# EasyEDA Pro project hub+remap_2025-11-01.epro

# Board hub+remap
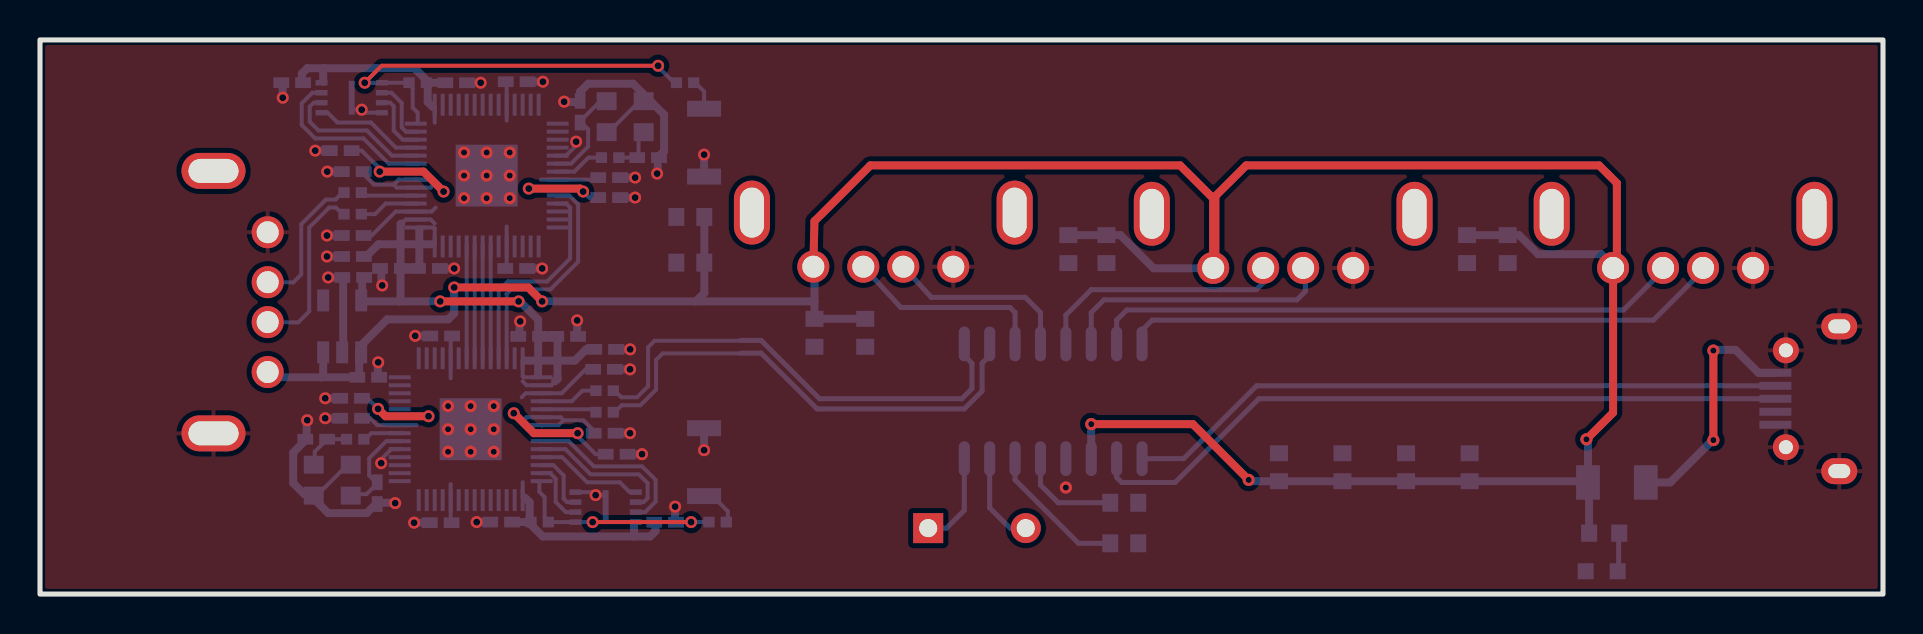
[diagram p0: board, top side]
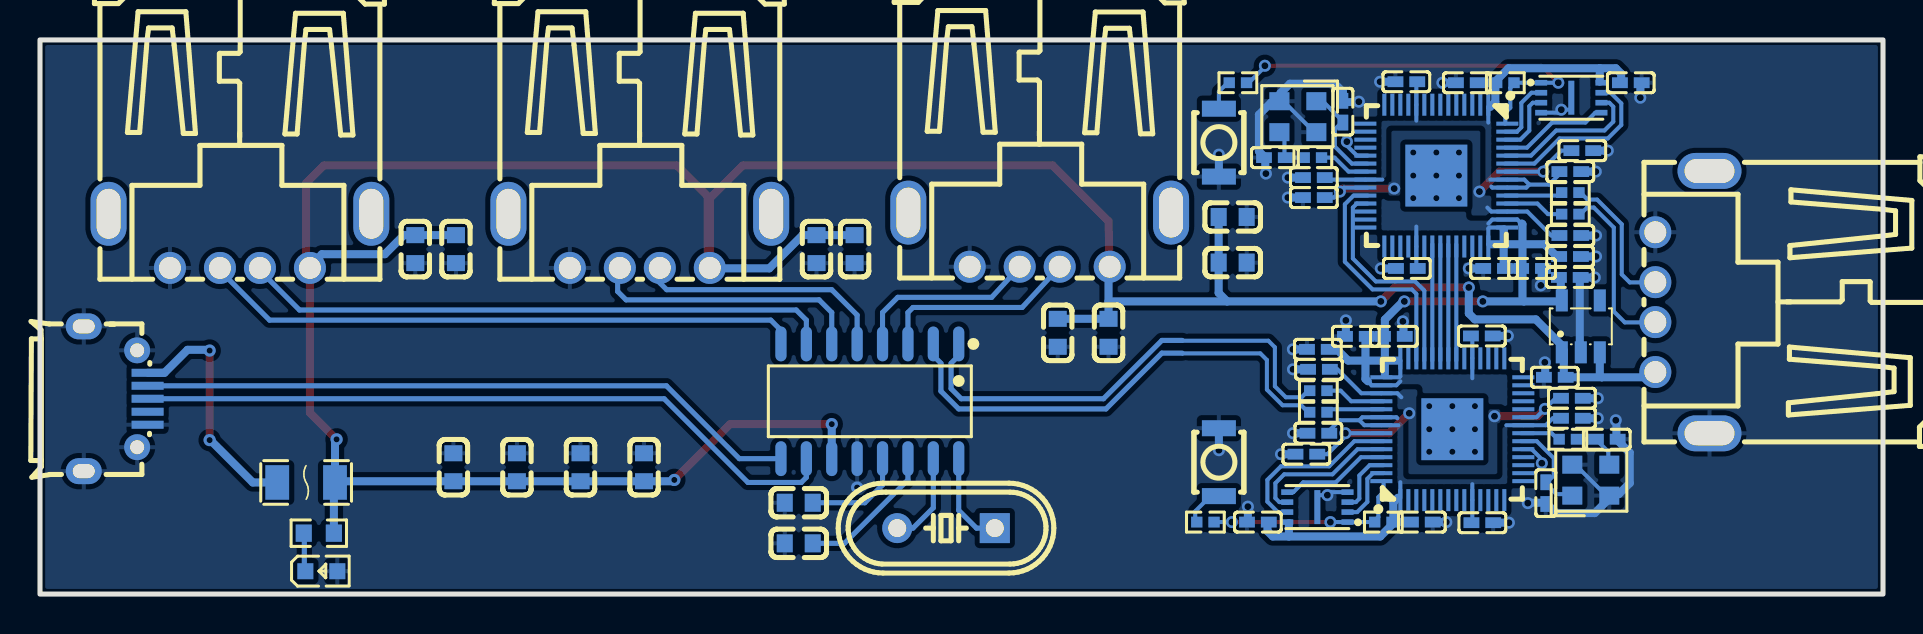
[diagram p1: board, bottom side, seen from below]

Outline 92.18 x 27.75 mm; copper layers: Top Layer, Bottom Layer. Coordinates in mm from the lower left corner of the outline.
Outline path: rectangle 92.18,0 0,27.75
Stack: Top Layer 0.035mm / Dielectric1 1.51mm FR4 er 4.5 / Bottom Layer 0.035mm

## Design rules (mm)
template: JLCPCB Capability(Two Layers Board)
spacing copperThickness1oz (default): track to track 0.102, other pairs 0.152 to 0.3
spacing copperThickness2oz: track to track 0.203, other pairs 0.152 to 0.3
track width copperThickness1oz (default): min 0.127, default 0.254, max 2.54
track width copperThickness2oz: min 0.203, default 0.254, max 2.54
differential pair differentialPair (default): width min 0.127, default 0.254, max 2.54; gap min 0.152, default 0.152
via viaSize (default): diameter min 0.5, default 0.61, max 10; hole min 0.3, default 0.305, max 6.3

## Placement (name value [footprint] x y rotation side)
C1  -  [C0603]  54.23 2.54 0 bottom
C1#2  -  [C0402]  15.04 22.2 180 bottom
C2  -  [C0603]  54.23 4.57 0 bottom
C2#2  -  [C0402]  28.47 19.85 0 bottom
C3  -  [C0603]  73.41 17.27 270 bottom
C3#2  -  [C0402]  15.64 21.15 180 bottom
C4  -  [C0603]  32.53 18.88 180 bottom
C4#2  -  [C0402]  20.82 25.6 0 bottom
C5  -  [C0603]  53.34 17.27 270 bottom
C5#2  -  [C0402]  23.82 16.3 0 bottom
C6  -  [C0603]  71.37 17.27 270 bottom
C6#2  -  [C0402]  23.84 25.65 0 bottom
C7  -  [C0603]  51.44 17.27 270 bottom
C7#2  -  [C0402]  28.47 20.85 0 bottom
C8  -  [C0603]  68.32 6.35 90 bottom
C8#2  -  [C0402]  19.45 16.3 0 bottom
C9  -  [C0603]  38.74 13.08 270 bottom
C9#2  -  [C0402]  17.55 16.3 180 bottom
C10  -  [C0603]  41.28 13.08 270 bottom
C10#2  -  [C0402]  15.65 16.9 180 bottom
C11  10uF  [C0603]  65.14 6.35 90 bottom
C12  100nF  [C0603]  32.53 16.6 180 bottom
C13  -  [C0603]  71.5 6.35 90 bottom
C13#2  -  [C0402]  15.64 17.95 180 bottom
C14  100nF  [C0603]  61.97 6.35 90 bottom
C15  1uF  [C0402]  16.42 10.85 0 bottom
C16  1uF  [C0402]  15.67 15.85 180 bottom
C17  100nF  [C0402]  12.62 25.6 180 bottom
C18  15pF  [C0402]  27.02 24.15 270 bottom
C19  15pF  [C0402]  30.41 21.85 0 bottom
C101  100nF  [C0402]  28.84 7 0 bottom
C102  100nF  [C0402]  15.56 9.8 180 bottom
C103  100nF  [C0402]  28.24 8.05 0 bottom
C104  100nF  [C0402]  23.07 3.6 180 bottom
C105  100nF  [C0402]  20.07 12.92 180 bottom
C106  100nF  [C0402]  20.04 3.57 180 bottom
C107  100nF  [C0402]  15.56 8.8 180 bottom
C108  100nF  [C0402]  24.47 12.9 180 bottom
C109  100nF  [C0402]  26.37 12.9 0 bottom
C110  1uF  [C0402]  28.27 12.25 0 bottom
C113  1uF  [C0402]  28.21 11.25 0 bottom
C117  100nF  [C0402]  31.27 3.6 0 bottom
C118  15pF  [C0402]  16.87 5.05 90 bottom
C119  15pF  [C0402]  13.82 7.75 180 bottom
F1  FSMD100-1206R  [F1206]  78.87 5.59 0 bottom
LED1  19-217/R6C-AL1M2VY/3T  [LED0603-RD]  78.11 1.14 180 bottom
R1  2kΩ  [R0603]  78.23 3.05 0 bottom
R3  27Ω  [R0402]  15.64 20.1 0 bottom
R4  27Ω  [R0402]  15.64 19.02 0 bottom
R5  10kΩ  [R0402]  18.89 25.6 180 bottom
R6  1kΩ  [R0402]  32.27 25.6 0 bottom
R7  1kΩ  [R0402]  28.52 21.85 180 bottom
R103  27Ω  [R0402]  28.24 9.1 180 bottom
R104  27Ω  [R0402]  28.24 10.18 180 bottom
R105  10kΩ  [R0402]  24.99 3.6 0 bottom
R106  1kΩ  [R0402]  33.89 3.6 0 bottom
R107  1kΩ  [R0402]  15.77 7.75 0 bottom
SW2  B3U-1000P  [KEY-SMD_B3U-1000PM]  33.22 22.6 90 bottom
SW102  B3U-1000P  [KEY-SMD_B3U-1000PM]  33.22 6.6 270 bottom
U1  SL2.1A  [SOP-16_L10.0-W3.9-P1.27-LS6.0-BL]  50.67 9.65 0 bottom
U3  RP2040  [LQFN-56_L7.0-W7.0-P0.4-EP]  22.34 20.95 270 bottom
U4  TLV73333PDBVR  [SOT-23-5_L3.0-W1.7-P0.95-LS2.8-BR]  15.12 13.4 270 bottom
U5  W25Q16JVUXIQ  [USON-8_L3.0-W2.0-P0.50-BL-EP]  15.59 24.85 270 bottom
U103  RP2040  [LQFN-56_L7.0-W7.0-P0.4-EP]  21.54 8.25 90 bottom
U105  W25Q16JVUXIQ  [USON-8_L3.0-W2.0-P0.50-BL-EP]  28.29 4.35 90 bottom
USB1  -  [USB-A-TH_USB-302-T]  10.03 14.62 90 bottom
USB1#2  -  [MICRO-USB-SMD_MICROXNJ]  88.39 9.78 270 bottom
USB2  U-USBAR04P-F002  [USB-A-TH_USB-302-T]  82.18 17.69 0 bottom
USB3  U-USBAR04P-F002  [USB-A-TH_USB-302-T]  62.18 17.69 0 bottom
USB4  U-USBAR04P-F002  [USB-A-TH_USB-302-T]  42.18 17.75 0 bottom
X1  12MHz  [HC-49US_L11.5-W4.5-P4.88]  46.86 3.3 0 bottom
Y1  12MHz  [CRYSTAL-SMD_4P-L2.5-W2.0-BL-A]  29.27 23.9 0 bottom
Y101  12MHz  [CRYSTAL-SMD_4P-L2.5-W2.0-BL-A]  14.62 5.7 180 bottom

## Footprints (pads in the part's own frame, mm; a bottom-side part is the same pattern mirrored in y, then rotated)
C0402
  rect 0.79x0.54 smd: 1(-0.545,0) 2(0.545,0)
C0603
  rect 0.8x0.9 smd: 1(-0.7,0) 2(0.7,0)
CRYSTAL-SMD_4P-L2.5-W2.0-BL-A
  rect 1x0.9 smd: 1(-0.925,-0.775) 2(0.925,-0.775) 3(0.925,0.775) 4(-0.925,0.775)
F1206
  rect 1.19x1.728 smd: 1(-1.445,0) 2(1.445,0)
HC-49US_L11.5-W4.5-P4.88
  rect 1.5x1.5 hole 0.9: 1(-2.44,0)
  round 1.5 hole 0.9: 2(2.44,0)
KEY-SMD_B3U-1000PM
  rect 0.8x1.7 smd: 1(-1.7,0) 2(1.7,0)
LED0603-RD
  rect 0.8x0.8 smd: 1(-0.799,0) 2(0.799,0)
LQFN-56_L7.0-W7.0-P0.4-EP
  rect 1.1x0.2 smd: 1(-3.55,2.6) 2(-3.55,2.2) 3(-3.55,1.8) 4(-3.55,1.4) 5(-3.55,1) 6(-3.55,0.6) 7(-3.55,0.2) 8(-3.55,-0.2) 9(-3.55,-0.6) 10(-3.55,-1) 11(-3.55,-1.4) 12(-3.55,-1.8) 13(-3.55,-2.2) 14(-3.55,-2.6) 29(3.55,-2.6) 30(3.55,-2.2) 31(3.55,-1.8) 32(3.55,-1.4) 33(3.55,-1) 34(3.55,-0.6) 35(3.55,-0.2) 36(3.55,0.2) 37(3.55,0.6) 38(3.55,1) 39(3.55,1.4) 40(3.55,1.8) 41(3.55,2.2) 42(3.55,2.6)
  rect 0.2x1.1 smd: 15(-2.6,-3.55) 16(-2.2,-3.55) 17(-1.8,-3.55) 18(-1.4,-3.55) 19(-1,-3.55) 20(-0.6,-3.55) 21(-0.2,-3.55) 22(0.2,-3.55) 23(0.6,-3.55) 24(1,-3.55) 25(1.4,-3.55) 26(1.8,-3.55) 27(2.2,-3.55) 28(2.6,-3.55) 43(2.6,3.55) 44(2.2,3.55) 45(1.8,3.55) 46(1.4,3.55) 47(1,3.55) 48(0.6,3.55) 49(0.2,3.55) 50(-0.2,3.55) 51(-0.6,3.55) 52(-1,3.55) 53(-1.4,3.55) 54(-1.8,3.55) 55(-2.2,3.55) 56(-2.6,3.55)
  rect 3.1x3.1 smd: 57(0,0)
MICRO-USB-SMD_MICROXNJ
  rect 0.4x1.6 smd: 1(-1.3,1.597) 2(-0.65,1.597) 3(0,1.597) 4(0.65,1.597) 5(1.3,1.597)
  round 1.3 hole 0.7: 6(2.425,1.074) 9(-2.425,1.073)
  oval 1.3x1.8 hole 0.7x1.1: 7(3.625,-1.597) 8(-3.625,-1.597)
R0402
  rect 0.566x0.54 smd: 1(-0.433,0) 2(0.433,0)
R0603
  rect 0.806x0.864 smd: 1(-0.753,0) 2(0.753,0)
SOP-16_L10.0-W3.9-P1.27-LS6.0-BL
  oval 0.56x1.745 smd: 1(-4.445,-2.873) 2(-3.175,-2.873) 3(-1.905,-2.873) 4(-0.635,-2.873) 5(0.635,-2.873) 6(1.905,-2.873) 7(3.175,-2.873) 8(4.445,-2.873) 9(4.445,2.873) 10(3.175,2.873) 11(1.905,2.873) 12(0.635,2.873) 13(-0.635,2.873) 14(-1.905,2.873) 15(-3.175,2.873) 16(-4.445,2.873)
SOT-23-5_L3.0-W1.7-P0.95-LS2.8-BR
  rect 1.1x0.6 smd: 1(1.3,-0.95) 2(1.3,0) 3(1.3,0.95) 4(-1.3,0.95) 5(-1.3,-0.95)
USB-A-TH_USB-302-T
  round 1.6 hole 1.1: 1(-3.5,1.355) 2(-1,1.355) 3(1,1.355) 4(3.5,1.355)
  oval 1.8x3.2 hole 1.2x2.5: 5(-6.57,-1.355) 6(6.57,-1.355)
USON-8_L3.0-W2.0-P0.50-BL-EP
  rect 0.28x0.6 smd: 1(-0.75,-1.508) 2(-0.25,-1.508) 3(0.25,-1.508) 4(0.75,-1.508) 5(0.75,1.508) 6(0.25,1.508) 7(-0.25,1.508) 8(-0.75,1.508)
  rect 1.7x0.3 smd: 9(0,0)

## Nets
+1V1: C1#2.1 C2#2.1 C13#2.1 U3.23 U3.45 U3.50
+1V2: C101.1 C102.1 C113.1 U103.23 U103.45 U103.50
+3V3: C3#2.1 C4#2.1 C5#2.1 C6#2.1 C7#2.1 C8#2.1 C9#2.1 C10#2.1 C16.1 C17.1 C103.1 C104.1 C105.1 C106.1 C107.1 C108.1 C109.1 C110.1 C117.1 R5.1 R105.1 U3.1 U3.10 U3.22 U3.33 U3.42 U3.43 U3.44 U3.48 U3.49 U4.5 U5.8 U103.1 U103.10 U103.22 U103.33 U103.42 U103.43 U103.44 U103.48 U103.49 U105.8
+5V: C3.1 C4.1 C5.1 C6.1 C7.1 C8.1 C9.1 C10.1 C11.1 C12.1 C13.1 C14.1 C15.1 F1.1 R1.1 U1.11 U4.1 U4.3 USB1.1 USB2.1 USB3.1 USB4.1
GND: C1.2 C1#2.2 C2.2 C2#2.2 C3.2 C3#2.2 C4.2 C4#2.2 C5.2 C5#2.2 C6.2 C6#2.2 C7.2 C7#2.2 C8.2 C8#2.2 C9.2 C9#2.2 C10.2 C10#2.2 C11.2 C12.2 C13.2 C13#2.2 C14.2 C15.2 C16.2 C17.2 C18.1 C19.2 C101.2 C102.2 C103.2 C104.2 C105.2 C106.2 C107.2 C108.2 C109.2 C110.2 C113.2 C117.2 C118.1 C119.2 LED1.2 SW2.1 SW102.1 U1.12 U3.19 U3.57 U4.2 U5.4 U103.19 U103.57 U105.4 USB1.4 USB1.5 USB1#2.5 USB1#2.6 USB1#2.7 USB1#2.8 USB1#2.9 USB2.4 USB3.4 USB4.4 Y1.2 Y1.4 Y101.2 Y101.4
VBUS: F1.2 USB1#2.1
VDD18: C1.1 U1.14
VDD33: C2.1 U1.13
1D+: R103.1
1D-: R104.1
1GPIO0: U103.2
1GPIO1: U103.3
1GPIO4: U103.6
1GPIO5: U103.7
1QSPI_SCLK: U103.52 U105.6
1QSPI_SD0: U103.53 U105.5
1QSPI_SD1: U103.55 U105.2
1QSPI_SD2: U103.54 U105.3
1QSPI_SD3: U103.51 U105.7
1QSPI_SS: R105.2 R106.1 U103.56 U105.1
1XIN: C118.2 U103.20 Y101.1
1XOUT: R107.2 U103.21
$C19_1: C19.1 R7.1 Y1.3
$C119_1: C119.1 R107.1 Y101.3
$LED1_1: LED1.1 R1.2
$R3_2: R3.2 U3.47
$R4_2: R4.2 U3.46
$R6_2: R6.2 SW2.2
$R103_2: R103.2 U103.47
$R104_2: R104.2 U103.46
$R106_2: R106.2 SW102.2
CTS1RTS: U3.38 U103.35
D+: R3.1 USB1.3
D-: R4.1 USB1.2
DM: U1.9 USB1#2.2
DM1: U1.7 USB2.2
DM2: U1.5 USB3.2
DM3: U1.3 USB4.2
DM4: U1.1
DP: U1.10 USB1#2.3
DP1: U1.8 USB2.3
DP2: U1.6 USB3.3
DP3: U1.4 USB4.3
DP4: U1.2
GPIO0: U3.2
GPIO1: U3.3
GPIO4: U3.6
GPIO5: U3.7
QSPI_SCLK: U3.52 U5.6
QSPI_SD0: U3.53 U5.5
QSPI_SD1: U3.55 U5.2
QSPI_SD2: U3.54 U5.3
QSPI_SD3: U3.51 U5.7
QSPI_SS: R5.2 R6.1 U3.56 U5.1
RTS1CTS: U3.35 U103.38
RX1TX: U3.37 U103.36
SWCLK: U3.24 U103.40
SWD: U3.25 U103.39
TX1RX: U3.36 U103.37
XIN: C18.2 U1.16 U3.20 X1.1 Y1.1
XOUT: R7.2 U1.15 U3.21 X1.2

Pads without a net: U3 4 5 8 9 11 12 13 14 15 16 17 18 26 27 28 29 30 31 32 34 39 40 41; U4 4; U5 9; U103 4 5 8 9 11 12 13 14 15 16 17 18 24 25 26 27 28 29 30 31 32 34 41; U105 9; USB1 6; USB1#2 4; USB2 5 6; USB3 5 6; USB4 5 6

## Via types
v1: diameter 0.6, hole 0.35, Top Layer to Bottom Layer, 52 vias
v2: diameter 0.61, hole 0.305, Top Layer to Bottom Layer, 24 vias

## Routing (per net, layer and track width the routed paths; a pad name or vN(x,y) marks a point on that pad's centre or on a via; arc(x,y) is an arc through that point)
+1V1: length 17
  Top Layer w0.4: v1(27.16,20.15) 27.02,20.3 v1(24.45,20.3) ; v1(16.99,21.15) 19.19,21.15 v1(20.19,20.15)
  Bottom Layer w0.2: 15.52,22.2 16.09,22.2 16.99,21.3 v1(16.99,21.15) 18.9,21.15 ; 16.12,17.95 16.59,17.95 17.79,19.15 U3.45 19.59,19.15 19.79,19.35 ; 27.99,19.85 27.47,19.85 v1(27.16,20.15) 26.97,20.35 25.78,20.35
+1V2: length 16.9
  Top Layer w0.4: v1(19.43,8.9) 17.28,8.9 v1(16.91,9.27) ; 23.7,9.05 24.7,8.05 26.9,8.05
  Bottom Layer w0.2: 16.04,9.8 16.38,9.8 v1(16.91,9.27) 17.33,8.85 18.1,8.85 ; 24.98,8.05 v1(26.89,8.05) 26.89,7.9 27.79,7 28.36,7 ; 27.73,11.25 27.29,11.25 26.09,10.05 U103.45 24.29,10.05 24.09,9.85
  vias: v1(23.7,9.05)
+3V3: length 85.6
  Top Layer w0.4: v1(20.02,14.65) v1(23.94,14.65)
  Bottom Layer w0.2: 23.34,23.7 U3.10 23.34,25.63 23.36,25.65 ; 16.12,21.15 16.12,21.09 16.7,20.5 17.69,20.5 ; 17.69,20.5 17.94,20.75 U3.49 19.64,20.75 ; 17.69,20.5 17.84,20.35 U3.48 19.54,20.35 19.59,20.4 ; 20.54,5.5 U103.10 20.54,3.59 20.52,3.57 ; 27.99,20.85 27.89,20.75 U3.22 25.04,20.75 ; 25.59,10.45 24.34,10.45 24.14,10.65 ; 26.19,8.7 27.18,8.7 27.76,8.12 27.76,8.05 ; 26.19,8.7 25.94,8.45 U103.49 24.24,8.45 ; 26.19,8.7 26.04,8.85 U103.48 24.34,8.85 24.29,8.8 ; 20.55,12.92 20.54,12.92 U103.33 20.54,10.8 ; 23.34,18.4 U3.33 23.34,16.31 23.34,16.3 ; 19.74,18.55 19.54,18.75 18.29,18.75 18.09,18.55 ; 18.84,8.45 U103.22 16.87,8.45 16.52,8.8 16.04,8.8 ; 18.9,18.35 19.69,18.35 19.74,18.3 19.74,17.52 ; 24.14,4.82 24.14,5.6 ; 24.14,11.69 24.14,10.9 24.19,10.85 24.98,10.85 ; 19.74,24.39 19.74,23.6 ; 25.58,10.47 25.77,10.65
  Bottom Layer w0.4: 29.72,2.88 25.14,2.88 24.48,3.55 24.48,3.6 ; 29.72,2.88 29.72,3.55 ; 29.72,2.88 30.52,2.88 30.78,3.15 30.78,3.6 ; 19.4,25.6 19.4,25.66 18.73,26.33 14.17,26.33 ; 19.4,25.6 19.39,25.59 19.39,24.64 19.64,24.39 ; 19.4,25.6 20.34,25.6 ; 24.92,11.69 24.92,11 ; 24.92,11.69 24.24,11.69 ; 24.92,11.69 25.89,11.69 ; 24.92,11.69 24.92,12.87 24.95,12.9 ; 18.03,17.52 18.03,18.52 18.07,18.55 ; 18.03,17.52 18.03,16.3 ; 18.03,17.52 18.97,17.52 ; 18.03,17.52 16.93,17.52 16.32,16.9 16.13,16.9 ; 25.89,11.69 25.89,10.77 25.77,10.65 ; 25.89,11.69 25.89,12.9 24.95,12.9 ; 25.89,11.69 26.75,11.69 27.31,12.25 27.78,12.25 ; 18.03,16.3 18.97,16.3 18.97,17.52 ; 18.03,16.3 18.03,14.72 17.97,14.65 ; 14.17,26.33 14.17,25.65 ; 14.17,26.33 13.37,26.33 13.1,26.06 13.1,25.6 ; 18.97,18.25 18.97,18.25 18.97,17.52 ; 24.95,12.9 24.92,12.93 24.92,13.74 24,14.65 v1(23.94,14.65) ; 24.48,3.6 24.49,3.61 24.49,4.59 24.26,4.82 ; 24.48,3.6 23.55,3.6 ; 18.97,17.52 19.64,17.52 ; 16.12,14.55 16.12,15.82 16.15,15.85 ; 16.12,14.55 16.07,14.5 ; 16.12,14.55 16.22,14.65 17.97,14.65 ; 17.97,14.65 v1(20.02,14.65)
+5V: length 156.5
  Top Layer w0.4: v1(25.12,14.65) 24.42,15.35 v1(20.72,15.35) ; v2(52.58,8.51) 57.66,8.51 v2(60.45,5.72) ; USB3.1 58.68,19.81 57.02,21.46 41.53,21.46 38.74,18.67 USB4.1 ; v2(77.34,7.75) 78.68,9.08 USB2.1 ; 58.79,16.31 58.79,19.92 60.33,21.46 77.98,21.46 78.87,20.57 78.87,16.39 78.79,16.31
  Bottom Layer w0.4: 38.74,14.65 38.74,16.31 38.79,16.31 ; 38.74,14.65 C9.1 C10.1 ; 38.74,14.65 32.8,14.65 ; 77.42,5.59 77.48,5.53 77.48,3.05 ; 77.42,5.59 77.42,7.67 ; 77.42,5.59 77.36,5.65 C13.1 C8.1 C11.1 C14.1 60.52,5.65 v2(60.45,5.72) ; 71.37,17.97 73.97,17.97 74.93,17.02 78.08,17.02 78.79,16.31 ; 32.8,14.65 v1(25.12,14.65) ; 32.8,14.65 33.23,15.08 33.23,18.88 ; v2(52.58,8.51) U1.11 ; 11.36,11.1 11.61,10.85 14.07,10.85 ; 14.17,12.3 14.17,10.95 14.07,10.85 ; 14.07,10.85 15.94,10.85 15.97,10.88 15.97,12.2 16.07,12.3 16.07,12.45 17.37,13.75 20.42,13.75 20.72,14.05 v1(20.72,15.35) ; 51.44,17.97 54.04,17.97 55.7,16.31 58.79,16.31
GND: length 56.3
  Bottom Layer w0.2: 15.49,6.4 15.32,6.4 13.92,5 13.74,5 ; v1(26.81,22.65) 26.81,22.46 26.31,21.95 25.78,21.95 ; 18.1,7.25 17.57,7.25 17.07,6.75 v1(17.07,6.55) ; 26.87,5.1 27.64,5.1 v1(27.79,4.95) 28.29,4.95 ; 28.39,23.2 28.51,23.2 29.91,24.6 30.14,24.6 ; 15.59,24.25 v1(16.09,24.25) 16.24,24.1 17.02,24.1
  Bottom Layer w0.4: 15.16,21.15 v1(14.37,21.15) ; 29.32,7 v1(30.11,7) ; v1(26.22,24.65) 26.23,24.63 27.02,24.63 27.02,25.15 27.41,25.55 29.66,25.55 30.14,25.08 30.14,24.6 30.61,24.6 31.22,24 31.22,22.17 30.9,21.85 30.9,21.08 v1(30.87,21.05) ; 21.3,25.6 v1(22.04,25.6) ; 28.69,11.25 v1(29.51,11.25) ; v1(25.15,25.65) 24.32,25.65 ; 19.59,12.92 19.58,12.93 v1(18.77,12.93) ; v1(29.77,20.85) 28.94,20.85 ; 28.72,8.05 v1(29.51,8.05) ; 15.16,17.95 v1(14.35,17.95) ; v1(13.37,8.7) 13.34,8.67 13.34,7.75 12.67,7.08 12.67,5.55 13.22,5 13.74,5 13.74,4.73 14.42,4.05 16.35,4.05 16.87,4.57 17.75,4.57 v1(17.77,4.55) ; v1(18.71,3.57) 19.56,3.57 ; 15.17,16.9 v1(14.35,16.9) ; SW2.1 v1(33.22,22) ; v1(12.14,24.85) 12.14,24.86 12.14,25.6 ; v1(14.27,8.8) 15.08,8.8 ; 22.59,3.6 v1(21.84,3.6) ; v1(31.77,4.38) 31.77,3.62 31.75,3.6 ; 14.56,22.2 v1(13.77,22.2) ; 15.12,12.3 15.17,12.35 15.17,15.83 15.19,15.85 v1(14.42,15.85) ; SW102.1 v1(33.22,7.2) ; v1(24.02,13.65) 23.98,13.62 23.98,12.9 ; v1(16.92,11.6) 16.9,11.58 16.9,10.85 ; 26.84,12.9 26.87,12.92 v1(26.87,13.7) ; 17.07,16.3 17.07,15.5 v1(17.12,15.45) ; v1(29.77,19.85) 28.94,19.85 ; v1(29.52,12.25) 28.75,12.25 ; v1(20.72,16.3) 19.93,16.3 ; v1(14.27,9.8) 15.08,9.8 ; v1(25.12,16.3) 24.3,16.3
  vias: v2(20.41,9.41) v2(20.41,8.25) v2(20.41,7.12) v2(21.21,22.11) v2(21.21,20.95) v2(21.21,19.82) v2(21.54,9.41) v2(21.54,8.25) v2(21.54,7.12) v2(22.34,22.11) v2(22.34,20.95) v2(22.34,19.82) v2(22.7,9.41) v2(22.7,8.25) v2(22.7,7.12) v2(23.5,22.11) v2(23.5,20.95) v2(23.5,19.82) v2(51.31,5.33)
VBUS: length 12.3
  Top Layer w0.4: v2(83.69,7.71) v2(83.69,12.19)
  Bottom Layer w0.4: USB1#2.1 85.95,11.08 84.8,12.23 83.73,12.23 v2(83.69,12.19) ; F1.2 81.53,5.59 83.66,7.71 v2(83.69,7.71)
VDD18: length 7.1
  Bottom Layer w0.254: U1.14 48.77,5.72 51.94,2.54 C1.1
VDD33: length 5.2
  Bottom Layer w0.254: C2.1 50.93,4.57 50.04,5.46 U1.13
1D+: length 4.5
  Bottom Layer w0.2: 31.14,12.05 30.81,11.72 30.81,10.24 30.03,9.45 29.1,9.45 28.75,9.1
1D-: length 4.4
  Bottom Layer w0.2: 28.75,10.18 29.08,9.85 29.86,9.85 30.41,10.4 30.41,12.36 30.74,12.68
1QSPI_SCLK: length 7.6
  Bottom Layer w0.2: 24.98,7.25 26.28,7.25 27.54,5.99 29.95,5.99 30.39,5.55 30.39,4.8 30.19,4.6 29.72,4.6
1QSPI_SD0: length 5.5
  Bottom Layer w0.2: 29.72,5.1 29.49,5.1 29,5.59 27.37,5.59 26.11,6.85 24.98,6.85
1QSPI_SD1: length 3.4
  Bottom Layer w0.2: 24.98,6.05 25.51,6.05 25.79,5.77 25.79,4.61 26.3,4.1 26.87,4.1
1QSPI_SD2: length 3.3
  Bottom Layer w0.2: 24.98,6.45 25.67,6.45 26.19,5.94 26.19,4.78 26.37,4.6 26.87,4.6
1QSPI_SD3: length 9
  Bottom Layer w0.2: 24.98,7.65 26.44,7.65 27.7,6.39 30.12,6.39 30.79,5.72 30.79,4.63 30.27,4.1 29.72,4.1
1QSPI_SS: length 10.1
  Top Layer w0.2: v1(27.64,3.6) v1(32.56,3.6)
  Bottom Layer w0.2: 24.98,5.65 24.98,5.12 25.24,4.85 25.24,3.86 25.5,3.6 U105.1 v1(27.64,3.6) ; v1(32.56,3.6) 33.38,3.6
1XIN: length 5
  Bottom Layer w0.2: 18.1,7.65 17.32,7.65 16.47,6.8 16.47,5.93 16.87,5.53 16.34,5 15.49,5
1XOUT: length 2
  Bottom Layer w0.2: 18.1,8.05 16.58,8.05 16.28,7.75
$C19_1: length 2.3
  Bottom Layer w0.2: 29.03,21.85 29.94,21.85 29.94,23 30.14,23.2
$C119_1: length 2.5
  Bottom Layer w0.2: 15.26,7.75 14.3,7.75 14.3,7.68 13.74,7.13 13.74,6.4
$LED1_1: length 1.9
  Bottom Layer w0.254: 78.99,3.05 78.96,3.02 78.96,1.14
$R3_2: length 2.8
  Bottom Layer w0.2: 18.9,19.95 16.3,19.95 16.15,20.1
$R4_2: length 3
  Bottom Layer w0.2: 16.15,19.02 16.76,19.02 17.29,19.55 18.9,19.55
$R6_2: length 1.5
  Bottom Layer w0.2: 32.78,25.6 33.22,25.16 SW2.2
$R103_2: length 2.8
  Bottom Layer w0.2: 24.98,9.25 27.58,9.25 27.73,9.1
$R104_2: length 3
  Bottom Layer w0.2: 27.73,10.18 27.12,10.18 26.59,9.65 24.98,9.65
$R106_2: length 2
  Bottom Layer w0.2: 34.4,3.6 34.4,4.14 33.64,4.9 SW102.2
CTS1RTS: length 5.8
  Bottom Layer w0.2: 21.34,17.52 21.34,11.69
D+: length 7.1
  Bottom Layer w0.2: 15.13,20.1 14.78,19.75 14.3,19.75 13.07,18.52 13.07,16 12.67,15.6 11.36,15.6
D-: length 8.7
  Bottom Layer w0.2: 15.13,19.02 14.8,19.35 14.47,19.35 13.47,18.35 13.47,14.15 12.91,13.6 11.36,13.6
DM: length 33.2
  Bottom Layer w0.254: U1.9 57.2,6.78 60.85,10.43 USB1#2.2
DM1: length 29.7
  Bottom Layer w0.254: U1.7 53.85,13.72 54.36,14.22 79.2,14.22 81.28,16.31
DM2: length 12.8
  Bottom Layer w0.254: U1.5 51.31,13.97 52.58,15.24 60.83,15.24 61.28,15.69 61.28,16.31
DM3: length 10.2
  Bottom Layer w0.254: U1.3 48.77,14.1 48.51,14.35 43.05,14.35 41.18,16.39
DM4: length 19.7
  Bottom Layer w0.2: 35.05,12.7 35.04,12.68 30.74,12.68
  Bottom Layer w0.254: U1.1 46.23,11.94 46.61,11.56 46.61,10.29 46.1,9.78 38.99,9.78 36.07,12.7 35.05,12.7
DP: length 35.7
  Bottom Layer w0.254: USB1#2.3 60.96,9.78 56.77,5.59 54.1,5.59 53.85,5.84 U1.10
DP1: length 30.1
  Bottom Layer w0.254: 83.29,16.31 80.69,13.72 55.63,13.72 55.12,13.21 U1.8
DP2: length 13.9
  Bottom Layer w0.254: 63.29,16.31 63.29,15.15 62.87,14.73 53.21,14.73 52.58,14.1 U1.6
DP3: length 9.4
  Bottom Layer w0.254: 43.18,16.39 44.58,14.86 49.28,14.86 50.04,14.1 U1.4
DP4: length 20
  Bottom Layer w0.2: 35.05,12.06 35.04,12.05 31.14,12.05
  Bottom Layer w0.254: 35.05,12.06 36.07,12.06 38.86,9.27 46.23,9.27 47.12,10.16 47.12,11.56 47.5,11.94 U1.2
QSPI_SCLK: length 7.6
  Bottom Layer w0.2: 18.9,21.95 17.61,21.95 16.35,23.21 13.93,23.21 13.49,23.65 13.49,24.4 13.69,24.6 14.17,24.6
QSPI_SD0: length 5.5
  Bottom Layer w0.2: 14.17,24.1 14.39,24.1 14.88,23.61 16.55,23.61 17.81,22.35 18.9,22.35
QSPI_SD1: length 3.4
  Bottom Layer w0.2: 17.02,25.1 17.58,25.1 18.09,24.59 18.09,23.37 18.31,23.15 18.9,23.15
QSPI_SD2: length 3.4
  Bottom Layer w0.2: 17.02,24.6 17.52,24.6 17.69,24.43 17.69,23.2 18.14,22.75 18.9,22.75
QSPI_SD3: length 9
  Bottom Layer w0.2: 18.9,21.55 17.44,21.55 16.18,22.81 13.77,22.81 13.09,23.49 13.09,24.57 13.62,25.1 14.17,25.1
QSPI_SS: length 20.7
  Top Layer w0.2: v1(30.91,26.45) 17.09,26.45 v1(16.24,25.6)
  Bottom Layer w0.2: 31.75,25.6 31.72,25.6 30.91,26.4 v1(30.91,26.45) ; 18.9,23.55 18.89,23.57 18.89,24.1 18.64,24.35 18.64,25.34 18.38,25.6 U5.1 v1(16.24,25.6)
RTS1CTS: length 5.8
  Bottom Layer w0.2: 22.54,17.52 22.54,11.69
RX1TX: length 5.8
  Bottom Layer w0.2: 21.74,17.52 21.74,11.69
SWCLK: length 11.8
  Bottom Layer w0.2: 25.78,19.95 26.48,19.95 26.91,19.52 26.91,16.64 25.53,15.25 23.57,15.25 23.34,15.03 23.34,11.69
SWD: length 11.1
  Bottom Layer w0.2: 25.78,19.55 26.32,19.55 26.52,19.35 26.52,16.8 25.37,15.65 23.4,15.65 22.94,15.19 22.94,11.69
TX1RX: length 5.8
  Bottom Layer w0.2: 22.14,17.52 22.14,11.69
XIN: length 9.9
  Bottom Layer w0.2: 28.39,24.6 27.94,24.6 27.02,23.67 27.41,23.27 27.41,22.41 26.56,21.55 25.78,21.55
  Bottom Layer w0.254: 44.42,3.3 45.34,3.3 46.23,4.19 U1.16
XOUT: length 7.2
  Bottom Layer w0.2: 28,21.85 27.43,21.85 26.73,21.15 25.78,21.15
  Bottom Layer w0.254: U1.15 47.5,4.32 48.51,3.3 49.3,3.3

## Copper pours and planes (outline as drawn; the poured copper is in the pictures)
+1V1 on Bottom Layer: 20.59,18.95 20.59,19.5 20.74,19.5 20.74,22.55 23.94,22.55 23.94,19.95 24.74,19.95 24.74,20.65 24.59,20.65 24.59,23.2 20.14,23.2 20.14,20.4 19.89,20.4 19.89,19.95 19.54,19.95 19.54,18.95
+1V2 on Bottom Layer: 23.29,10.25 23.29,9.7 23.14,9.7 23.14,6.65 19.94,6.65 19.94,9.25 19.14,9.25 19.14,8.55 19.29,8.55 19.29,6 23.74,6 23.74,8.8 23.99,8.8 23.99,9.25 24.34,9.25 24.34,10.25
+3V3 on Bottom Layer: 18.74,11.05 18.74,5.45 24.34,5.45 24.34,11.05
+3V3 on Bottom Layer: 25.14,18.15 25.14,23.75 19.54,23.75 19.54,18.15
GND on Top Layer: 0,27.75 92.18,27.75 92.18,0 0,0
GND on Bottom Layer: 0,27.75 92.18,27.75 92.18,0 0,0
